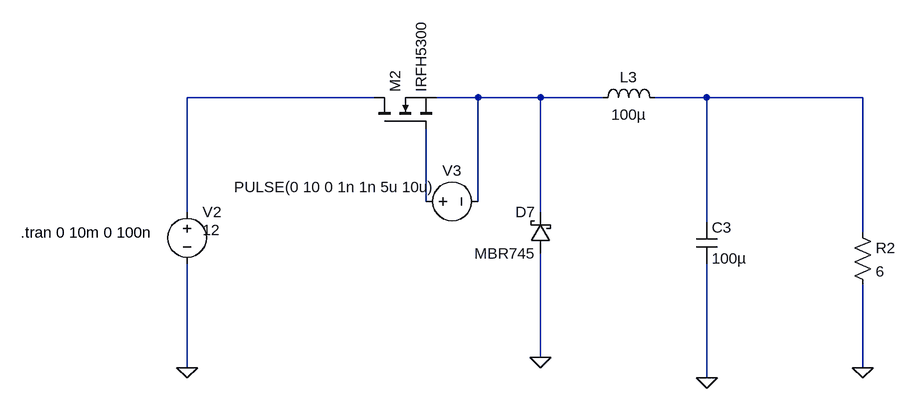
[diagram p0: schematic switched_psu_test.asc]
switched_psu_test.asc, the LTspice schematic file:
Version 4
SHEET 1 1236 680
WIRE -3104 -1232 -3392 -1232
WIRE -2944 -1232 -3008 -1232
WIRE -2848 -1232 -2944 -1232
WIRE -2752 -1232 -2848 -1232
WIRE -2592 -1232 -2672 -1232
WIRE -2352 -1232 -2592 -1232
WIRE -3024 -1072 -3024 -1184
WIRE -2944 -1072 -2944 -1232
WIRE -3392 -1056 -3392 -1232
WIRE -2848 -1056 -2848 -1232
WIRE -2592 -1040 -2592 -1232
WIRE -2352 -1024 -2352 -1232
WIRE -2848 -832 -2848 -992
WIRE -3392 -816 -3392 -976
WIRE -2352 -816 -2352 -944
WIRE -2592 -800 -2592 -976
FLAG -3392 -816 0
FLAG -2848 -832 0
FLAG -2592 -800 0
FLAG -2352 -816 0
SYMBOL nmos -3104 -1184 R270
SYMATTR InstName M2
SYMATTR Value IRFH5300
SYMBOL schottky -2832 -992 R180
WINDOW 0 24 64 Left 2
WINDOW 3 24 0 Left 2
SYMATTR InstName D7
SYMATTR Value MBR745
SYMATTR Description Diode
SYMATTR Type diode
SYMBOL ind -2768 -1216 R270
WINDOW 0 32 56 VTop 2
WINDOW 3 5 56 VBottom 2
SYMATTR InstName L3
SYMATTR Value 100µ
SYMBOL cap -2608 -1040 R0
SYMATTR InstName C3
SYMATTR Value 100µ
SYMBOL res -2368 -1040 R0
SYMATTR InstName R2
SYMATTR Value 6
SYMBOL voltage -3392 -1072 R0
WINDOW 123 0 0 Left 0
WINDOW 39 0 0 Left 0
WINDOW 3 24 44 Left 2
SYMATTR InstName V2
SYMATTR Value 12
SYMBOL voltage -3040 -1072 R270
WINDOW 0 32 56 VTop 2
WINDOW 3 38 -124 VBottom 2
WINDOW 123 0 0 Left 0
WINDOW 39 0 0 Left 0
SYMATTR InstName V3
SYMATTR Value PULSE(0 10 0 1n 1n 5u 10u)
TEXT -3648 -1024 Left 2 !.tran 0 10m 0 100n

The netlist it stands for:
* switched_psu_test.asc
M2 N001 N004 N002 N002 IRFH5300
D7 0 N002 MBR745
L3 N002 N003 100µ
C3 N003 0 100µ
R2 N003 0 6
V2 N001 0 12
V3 N004 N002 PULSE(0 10 0 1n 1n 5u 10u)
.model D D
.lib standard.dio
.model NMOS NMOS
.model PMOS PMOS
.lib standard.mos
.tran 0 10m 0 100n
.backanno
.end